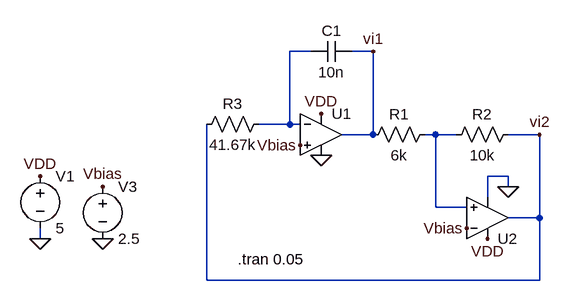
[diagram p0: schematic Q3.asc]
Q3.asc, the LTspice schematic file:
Version 4
SHEET 1 880 680
WIRE 208 32 176 32
WIRE 304 32 272 32
WIRE 176 144 176 32
WIRE 176 144 128 144
WIRE 192 144 176 144
WIRE 304 160 304 32
WIRE 304 160 256 160
WIRE 400 160 384 160
WIRE 432 160 400 160
WIRE 560 160 512 160
WIRE 512 224 480 224
WIRE 512 240 512 224
WIRE 480 256 480 224
WIRE 400 272 400 160
WIRE 448 272 400 272
WIRE 560 288 560 160
WIRE 560 288 512 288
WIRE -208 320 -208 304
WIRE 48 384 48 144
WIRE 560 384 560 288
WIRE 560 384 48 384
FLAG 192 176 Vbias
FLAG 304 32 vi1
FLAG -208 224 VDD
FLAG 224 128 VDD
FLAG 480 320 VDD
FLAG -112 320 0
FLAG -112 240 Vbias
FLAG 448 304 Vbias
FLAG 560 160 vi2
FLAG 224 192 0
FLAG 512 240 0
FLAG -208 320 0
SYMBOL OpAmps\\UniversalOpamp2 224 160 R0
SYMATTR InstName U1
SYMBOL OpAmps\\UniversalOpamp2 480 288 M180
SYMATTR InstName U2
SYMBOL res 400 144 R90
WINDOW 0 0 56 VBottom 2
WINDOW 3 32 56 VTop 2
SYMATTR InstName R1
SYMATTR Value 6k
SYMBOL res 528 144 R90
WINDOW 0 0 56 VBottom 2
WINDOW 3 32 56 VTop 2
SYMATTR InstName R2
SYMATTR Value 10k
SYMBOL res 144 128 R90
WINDOW 0 0 56 VBottom 2
WINDOW 3 32 56 VTop 2
SYMATTR InstName R3
SYMATTR Value 41.67k
SYMBOL cap 272 16 R90
WINDOW 0 0 32 VBottom 2
WINDOW 3 32 32 VTop 2
SYMATTR InstName C1
SYMATTR Value 10n
SYMBOL voltage -208 208 R0
WINDOW 123 0 0 Left 0
WINDOW 39 0 0 Left 0
SYMATTR InstName V1
SYMATTR Value 5
SYMBOL voltage -112 224 R0
WINDOW 123 0 0 Left 0
WINDOW 39 0 0 Left 0
SYMATTR InstName V3
SYMATTR Value 2.5
TEXT 96 352 Left 2 !.tran 0.05

The netlist it stands for:
* Q3.asc
XU1 Vbias N001 VDD 0 vi1 level.2 Avol=1Meg GBW=10Meg Slew=10Meg ilimit=25m rail=0 Vos=0 phimargin=45 en=0 enk=0 in=0 ink=0 Rin=500Meg  ; pins IN+ IN- V+ V- OUT
XU2 N002 Vbias VDD 0 vi2 level.2 Avol=1Meg GBW=10Meg Slew=10Meg ilimit=25m rail=0 Vos=0 phimargin=45 en=0 enk=0 in=0 ink=0 Rin=500Meg  ; pins IN+ IN- V+ V- OUT
R1 N002 vi1 6k
R2 vi2 N002 10k
R3 N001 vi2 41.67k
C1 vi1 N001 10n
V1 VDD 0 5
V3 Vbias 0 2.5
.tran 0.05
.lib UniversalOpamps2.sub
.backanno
.end